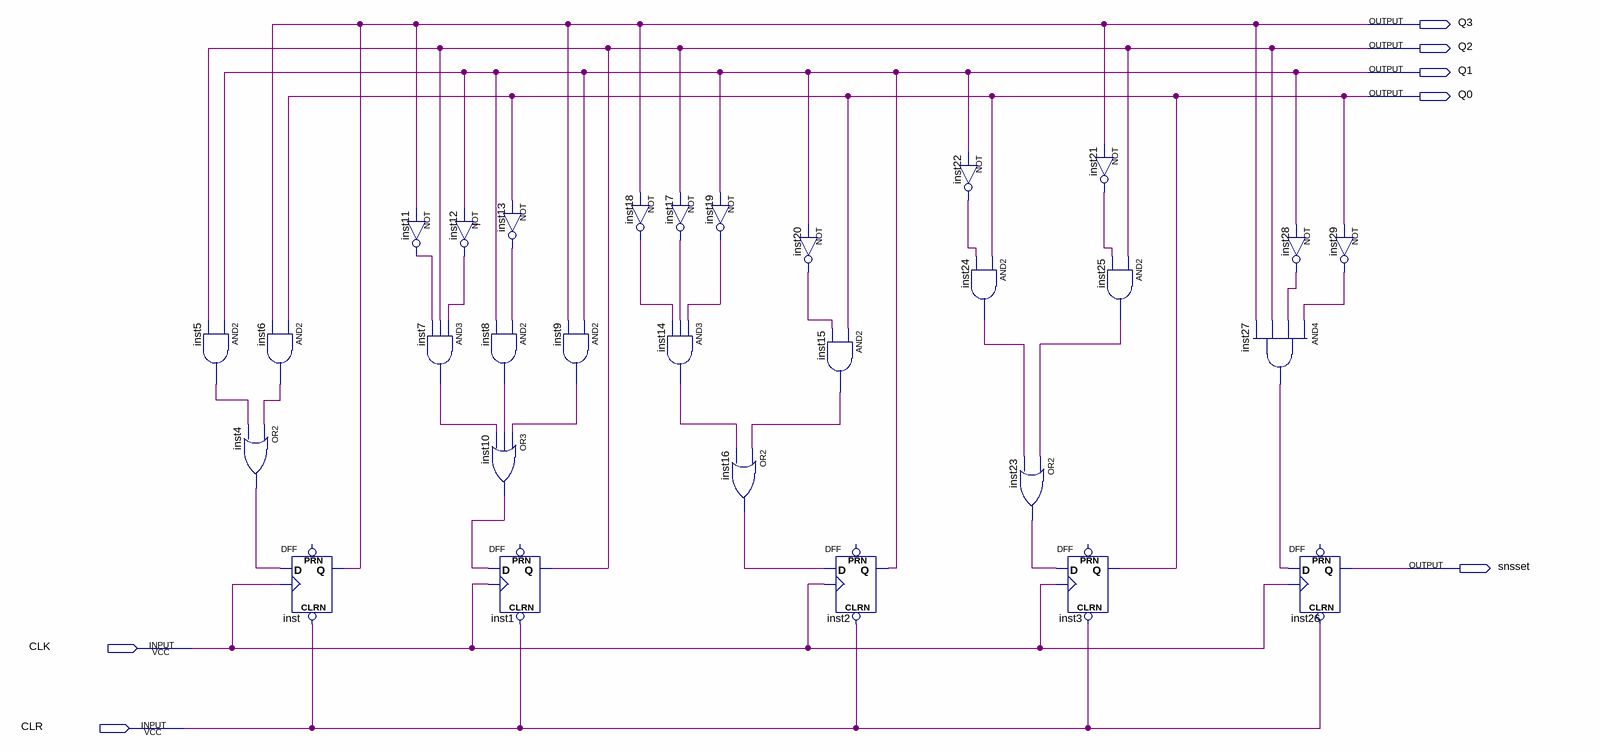
[diagram p0: schematic sheet]
// Quartus schematic MajorSense.bdf as structural Verilog: 30 symbols, 7 pins
module MajorSense (
  input  CLK,
  input  CLR,
  output Q3,
  output Q2,
  output Q1,
  output Q0,
  output snsset
);

  wire inst4_out, inst5_out, inst6_out, inst7_out, inst8_out, inst9_out, inst10_out, inst11_out, inst12_out,
       inst13_out, inst14_out, inst15_out, inst16_out, inst17_out, inst18_out, inst19_out, inst20_out,
       inst21_out, inst22_out, inst23_out, inst24_out, inst25_out, inst27_out, inst28_out, inst29_out;

  and inst5 (inst5_out, Q1, Q2);
  or inst4 (inst4_out, inst6_out, inst5_out);
  and inst6 (inst6_out, Q0, Q3);
  DFF inst (.CLRN(CLR), .CLK(CLK), .D(inst4_out), .Q(Q3));  // open: PRN
  not inst11 (inst11_out, Q3);
  and inst7 (inst7_out, inst12_out, Q2, inst11_out);
  not inst12 (inst12_out, Q1);
  and inst8 (inst8_out, inst13_out, Q1);
  or inst10 (inst10_out, inst9_out, inst8_out, inst7_out);
  DFF inst1 (.CLRN(CLR), .CLK(CLK), .D(inst10_out), .Q(Q2));  // open: PRN
  not inst13 (inst13_out, Q0);
  and inst9 (inst9_out, Q1, Q3);
  not inst17 (inst17_out, Q2);
  not inst18 (inst18_out, Q3);
  and inst14 (inst14_out, inst19_out, inst17_out, inst18_out);
  not inst19 (inst19_out, Q1);
  or inst16 (inst16_out, inst15_out, inst14_out);
  not inst20 (inst20_out, Q1);
  and inst15 (inst15_out, Q0, inst20_out);
  DFF inst2 (.CLRN(CLR), .CLK(CLK), .D(inst16_out), .Q(Q1));  // open: PRN
  not inst22 (inst22_out, Q1);
  and inst24 (inst24_out, Q0, inst22_out);
  or inst23 (inst23_out, inst25_out, inst24_out);
  DFF inst3 (.CLRN(CLR), .CLK(CLK), .D(inst23_out), .Q(Q0));  // open: PRN
  not inst21 (inst21_out, Q3);
  and inst25 (inst25_out, Q2, inst21_out);
  and inst27 (inst27_out, inst29_out, inst28_out, Q2, Q3);
  not inst28 (inst28_out, Q1);
  DFF inst26 (.CLRN(CLR), .CLK(CLK), .D(inst27_out), .Q(snsset));  // open: PRN
  not inst29 (inst29_out, Q0);
endmodule
